# Altium schematic sheet FEATHER.SchDoc
size A3; SheetNumber: 5; SheetTotal: 7
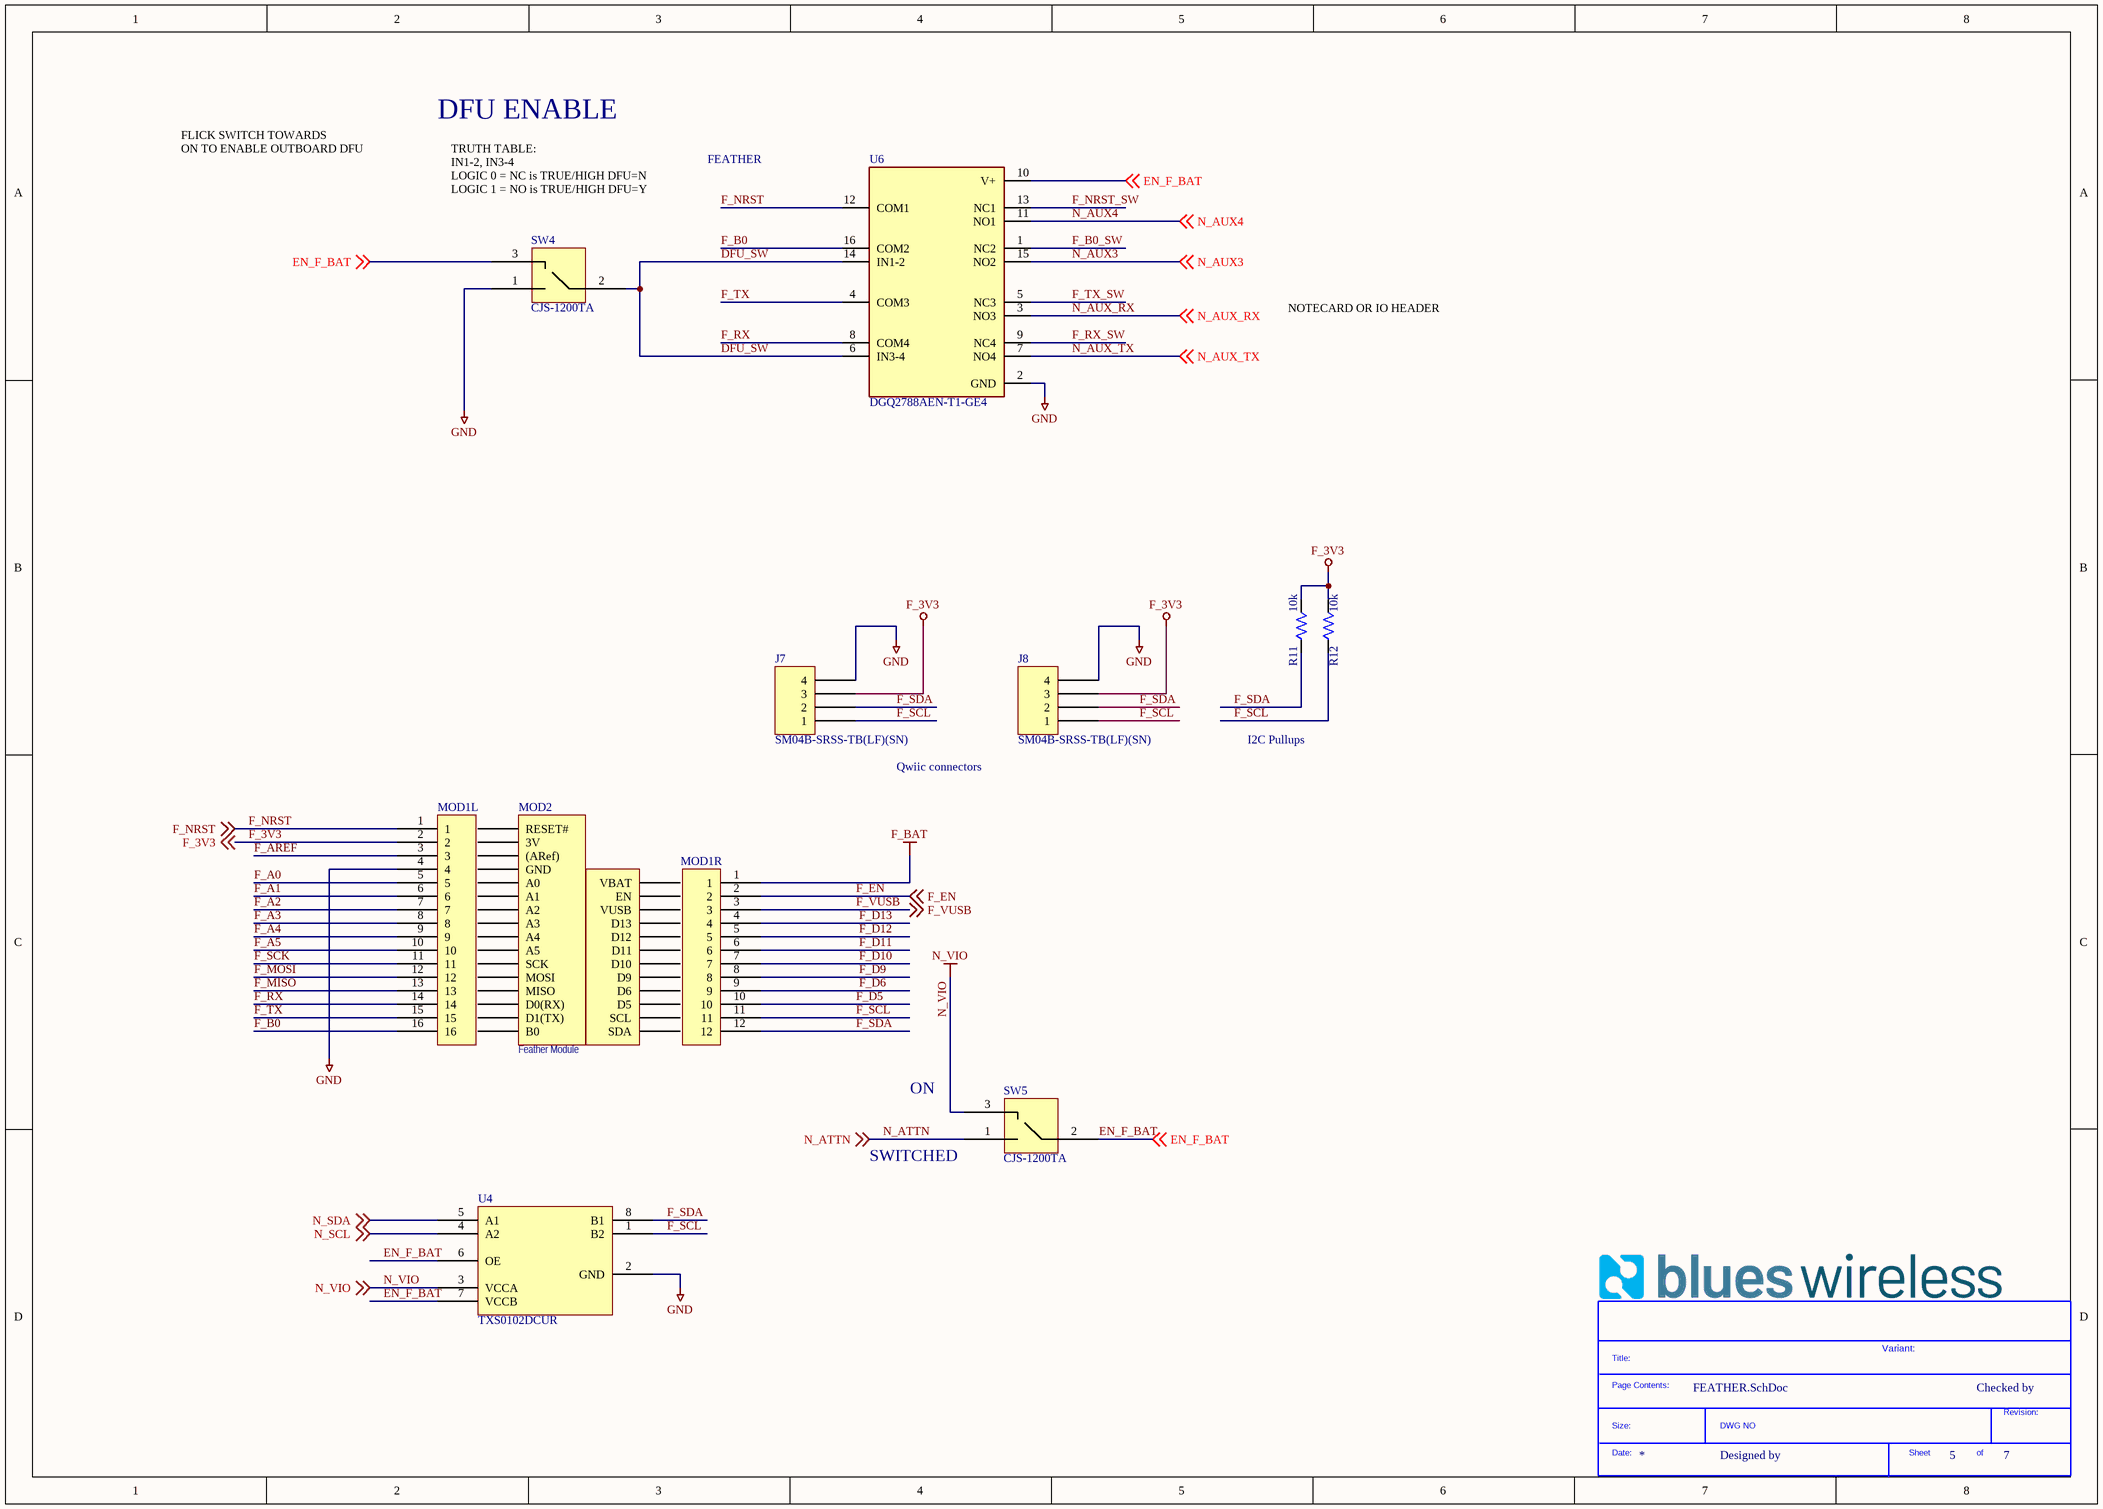
[diagram p0: FEATHER.SchDoc]

## Parts
*?  SDTitleBlock  (value not drawn)  (graphical)
J7  SM04B-SRSS-TB(LF)(SN)  [JST SM04B-SRSS-TB]
J8  SM04B-SRSS-TB(LF)(SN)  [JST SM04B-SRSS-TB]
MOD1L  Socket 16-Pin, 0.100 inch (0.335 inch body)  [16PIN_254MM]  (value not drawn)
MOD1R  Socket 12-Pin, 0.100 inch (0.335 inch body)  [12PIN_254MM]  (value not drawn)
MOD2  Feather Module  [BLUES_WIRELESS_SWAN_2-54_HEADERS]  (no BOM)
R11  10k  [RES 0402_1005]
R12  10k  [RES 0402_1005]
SW4  CJS-1200TA  [SW_CJS-1200TA]
SW5  CJS-1200TA  [SW_CJS-1200TA]
U4  TXS0102DCUR  [SOP50P310X90-8N]
U6  DGQ2788AEN-T1-GE4  [QFN40P260X180X60-16N]

## Nets
F_3V3: J7.3 J8.3 MOD1L.2 R11.2 R12.2 ; off-sheet F_3V3
F_BAT: MOD1R.1
GND: J7.4 J8.4 MOD1L.4 SW4.1 U4.2(GND) U6.2(GND)
N_VIO: SW5.3 U4.3(VCCA) ; off-sheet N_VIO
DFU_SW: SW4.2 U6.6(IN3-4) U6.14(IN1-2)
EN_F_BAT: SW4.3 SW5.2 U4.6(OE) U4.7(VCCB) U6.10(V+) ; off-sheet EN_F_BAT
F_A0: MOD1L.5
F_A1: MOD1L.6
F_A2: MOD1L.7
F_A3: MOD1L.8
F_A4: MOD1L.9
F_A5: MOD1L.10
F_AREF: MOD1L.3
F_B0: MOD1L.16 U6.16(COM2)
F_B0_SW: U6.1(NC2)
F_D5: MOD1R.10
F_D6: MOD1R.9
F_D9: MOD1R.8
F_D10: MOD1R.7
F_D11: MOD1R.6
F_D12: MOD1R.5
F_D13: MOD1R.4
F_EN: MOD1R.2 ; off-sheet F_EN
F_MISO: MOD1L.13
F_MOSI: MOD1L.12
F_NRST: MOD1L.1 U6.12(COM1) ; off-sheet F_NRST
F_NRST_SW: U6.13(NC1)
F_RX: MOD1L.14 U6.8(COM4)
F_RX_SW: U6.9(NC4)
F_SCK: MOD1L.11
F_SCL: J7.1 J8.1 MOD1R.11 R12.1 U4.1(B2)
F_SDA: J7.2 J8.2 MOD1R.12 R11.1 U4.8(B1)
F_TX: MOD1L.15 U6.4(COM3)
F_TX_SW: U6.5(NC3)
F_VUSB: MOD1R.3 ; off-sheet F_VUSB
N_ATTN: SW5.1 ; off-sheet N_ATTN
N_AUX3: U6.15(NO2) ; off-sheet N_AUX3
N_AUX4: U6.11(NO1) ; off-sheet N_AUX4
N_AUX_RX: U6.3(NO3) ; off-sheet N_AUX_RX
N_AUX_TX: U6.7(NO4) ; off-sheet N_AUX_TX
N_SCL: U4.4(A2) ; off-sheet N_SCL
N_SDA: U4.5(A1) ; off-sheet N_SDA

Not connected (* = marked no-connect by the designer): MOD2 1(RESET#) 2(3V) 3((ARef)) 4(GND) 5(A0) 6(A1) 7(A2) 8(A3) 9(A4) 10(A5) 11(SCK) 12(MOSI) 13(MISO) 14(D0(RX)) 15(D1(TX)) 16(B0) 17(SDA) 18(SCL) 19(D5) 20(D6) 21(D9) 22(D10) 23(D11) 24(D12) 25(D13) 26(VUSB) 27(EN) 28(VBAT)

## Notes on the sheet
- FLICK SWITCH TOWARDS
  ON TO ENABLE OUTBOARD DFU
- DFU ENABLE
- FEATHER
- (near SW4) TRUTH TABLE:
  IN1-2, IN3-4
  LOGIC 0 = NC is TRUE/HIGH DFU=N
  LOGIC 1 = NO is TRUE/HIGH DFU=Y
- NOTECARD OR IO HEADER
- Qwiic connectors
- I2C Pullups
- ON
- SWITCHED
- Variant:
- Checked by
- Designed by
- (in symbol SDTitleBlock) Title:; Page Contents:; Revision:; Size:; DWG NO; Date:; Sheet; of

## Library data of the parts
J7 J8 = SM04B-SRSS-TB(LF)(SN): CONN HEADER SH 4POS SIDE 1MM TIN; Manufacturer: JST; Number of Positions: 4; Connector Type: Male Pin; Contact Resistance: 40mR; Max Current Rating: 1A; Max Voltage Rating (AC): 50V; Pitch: 0.039inch; Supplier 1: Digi-Key; Manufacturer Part Number: SM04B-SRSS-TB(LF)(SN); RoHS: Yes; Category: Connectors; Pricing 1: 1=0.57000, 10=0.49300, 100=0.40630, 500=0.35328, 1000=0.29146 (USD); Mount: Surface Mount; Contact Material: Copper Alloy; Contact Plating: Tin,Copper; Color: Natural; Housing Color: Beige; Housing Material: Polyamide; Min Operating Temperature: -25°C; Max Operating Temperature: 85°C; Number of Rows: 1; Termination: Solder; Packaging: Tape and Reel; Orientation: Right Angle; Number of Contacts: 4; Max Voltage Rating (DC): 50V; Length: 6mm; Depth: 4.95mm; Lead Free: Lead Free; ComponentLink1URL: https://datasheet.ciiva.com/26894/getdatasheetpartid-640736-26894676.pdf?src-supplier=Verical; ComponentLink1Description: https://datasheet.ciiva.com/26894/getdatasheetpartid-640736-26894676.pdf?src-supplier=Verical; ComponentLink2URL: https://datasheet.ciiva.com/26894/getdatasheetpartid-499363-26894945.pdf?src-supplier=Verical; ComponentLink2Description: https://datasheet.ciiva.com/26894/getdatasheetpartid-499363-26894945.pdf?src-supplier=Verical; ComponentLink3URL: https://datasheet.ciiva.com/16487/jstsm04b-srss-tb-lf-sn-16487222.pdf?src-supplier=Future+Electronics; ComponentLink3Description: https://datasheet.ciiva.com/16487/jstsm04b-srss-tb-lf-sn-16487222.pdf?src-supplier=Future+Electronics; Supplier Part Number 1: 455-1804-1-ND
MOD1L = SOCKET_LFB_16: Socket 16-Pin, 0.100 in
MOD1R = SOCKET_LFB_12: Socket 12-Pin, 0.100 in
MOD2 = ADAFRUIT_FEATHER_COMMON_1: Typical Adafruit Feather Pinout
R11 R12 = RC1005F103CS: Res Thick Film 0402 10K Ohm 1% 1/16W ±100ppm/°C Molded SMD SMD T/R; Manufacturer: Samsung; Resistance: 10kR; Power Rating: 63mW; Supplier 1: Digi-Key; Manufacturer Part Number: RC1005F103CS; RoHS: Yes; Category: Chip SMD Resistors; Stock 1: 58620569; Pricing 1: 10000=0.00695 (USD); Mount: Surface Mount; Case/Package: 0402; Case Code (Metric): 1005; Case Code (Imperial): 0402; Contact Plating: Tin; Size Code: 0402; Min Operating Temperature: -55°C; Max Operating Temperature: 155°C; Tolerance: 1%; Packaging: Tape and Reel; Resistor Type: Thick Film; Package Quantity: 1; Number of Terminations: 2; Max Power Dissipation: 63mW; Temperature Coefficient: 100ppm/°C; Features: Moisture Resistant; Series: RC; Construction: Rectangular; Length: 0.039inch; Width: 0.02inch; Height: 0.016inch; Depth: 0.5mm; Radiation Hardening: No; Military Standard: Not; RoHS Compliant: Yes; ComponentLink1URL: https://datasheet.ciiva.com/15196/getdatasheetpartid-504789-15196214.pdf?src-supplier=Verical; ComponentLink1Description: https://datasheet.ciiva.com/15196/getdatasheetpartid-504789-15196214.pdf?src-supplier=Verical; ComponentLink2URL: https://datasheet.ciiva.com/16481/rcseries-16481007.pdf?src-supplier=Future+Electronics; ComponentLink2Description: https://datasheet.ciiva.com/16481/rcseries-16481007.pdf?src-supplier=Future+Electronics; Supplier Part Number 1: 1276-3431-2-ND
SW4 SW5 = CJS-1200TA: Switch Slide N.O./N.C. SPDT Raised Slide 0.1A 24VDC J-Hook SMD Embossed T/R; Manufacturer: Nidec Copal; Body Material: Polyphenylene; Voltage Rating (DC): 6V; Electrical Life: 200Cycles; Max Voltage Rating (DC): 24V; Current Rating: 100mA; Number of Positions: 2; Actuator Type: Slide (Standard); Washable: Yes; Supplier 1: Digi-Key; Manufacturer Part Number: CJS-1200TA; RoHS: Yes; Category: Slide Switches; Pricing 1: 1=0.81000, 10=0.78400, 25=0.75440, 100=0.65470, 250=0.59736, 500=0.55510 (USD); Mount: Surface Mount; Contact Material: Copper Alloy; Contact Plating: Gold; Min Operating Temperature: -40°C; Max Operating Temperature: 85°C; Packaging: Tape and Reel; Throw Configuration: SPDT; Termination: J-Hook; Series: CJS; Orientation: Vertical; Length: 0.212inch; Radiation Hardening: No; RoHS Compliant: Yes; Lead Free: Lead Free; ComponentLink1URL: https://datasheet.ciiva.com/2864/cjs-2864476.pdf?src-supplier=Digi-Key; ComponentLink1Description: https://datasheet.ciiva.com/2864/cjs-2864476.pdf?src-supplier=Digi-Key; ComponentLink2URL: https://datasheet.ciiva.com/2864/cjs-2864477.pdf?src-supplier=Digi-Key; ComponentLink2Description: https://datasheet.ciiva.com/2864/cjs-2864477.pdf?src-supplier=Digi-Key; ComponentLink3URL: https://datasheet.ciiva.com/2864/cjs-2864478.pdf?src-supplier=Digi-Key; ComponentLink3Description: https://datasheet.ciiva.com/2864/cjs-2864478.pdf?src-supplier=Digi-Key; Supplier Part Number 1: 563-1021-6-ND
U4 = TXS0102DCUR: 2-Bit Bidirectional Voltage-Level Shifter for Open-Drain and Push-Pull Application 8-VSSOP -40 to 85; Manufacturer: Texas Instruments; Min Supply Voltage: 1.65V; Max Supply Voltage: 5.5V; Data Rate: 24Mbps; Propagation Delay: 4.6ns; Logic Function: Translator; Number of Bits: 2; High Level Output Current: -20uA; Low Level Output Current: 1mA; Quiescent Current: 14.4uA; Turn-On Delay Time: 260ns; Output Current: 1A; Supplier 1: Digi-Key; Manufacturer Part Number: TXS0102DCUR; RoHS: Yes; Category: Voltage Level Shifters; Pricing 1: 1=0.80000, 10=0.70000, 25=0.65720, 100=0.53640, 250=0.49820, 500=0.42400, 1000=0.35000 (USD); Case/Package: VSSOP; Number of Pins: 8; Weight: 0.000339oz; Min Operating Temperature: -40°C; Max Operating Temperature: 85°C; Packaging: Tape and Reel; Package Quantity: 1; Number of Channels: 2; Number of Inputs: 2; Nominal Supply Current: 14.4uA; Output Type: Voltage; Radiation Hardening: No; Lead Free: Lead Free; RoHS Compliant: Yes; REACH SVHC: No SVHC; ComponentLink1URL: https://datasheet.ciiva.com/22653/1846850-22653373.pdf?src-supplier=Farnell; ComponentLink1Description: https://datasheet.ciiva.com/22653/1846850-22653373.pdf?src-supplier=Farnell; ComponentLink2URL: https://datasheet.ciiva.com/15096/getdatasheetpartid-118249-15096172.pdf?src-supplier=Verical; ComponentLink2Description: https://datasheet.ciiva.com/15096/getdatasheetpartid-118249-15096172.pdf?src-supplier=Verical; ComponentLink3URL: https://datasheet.ciiva.com/1508/1857232-1508821.pdf?src-supplier=Element14; ComponentLink3Description: https://datasheet.ciiva.com/1508/1857232-1508821.pdf?src-supplier=Element14; ComponentLink4URL: https://datasheet.ciiva.com/28499/1863639-28499676.pdf?src-supplier=Element14; ComponentLink4Description: https://datasheet.ciiva.com/28499/1863639-28499676.pdf?src-supplier=Element14; ComponentLink5URL: https://datasheet.ciiva.com/46395/1863639-46395871.pdf?src-supplier=Element14; ComponentLink5Description: https://datasheet.ciiva.com/46395/1863639-46395871.pdf?src-supplier=Element14; ComponentLink6URL: https://datasheet.ciiva.com/1899/txs0102-1899369.pdf?src-supplier=Digi-Key; ComponentLink6Description: https://datasheet.ciiva.com/1899/txs0102-1899369.pdf?src-supplier=Digi-Key; ComponentLink7URL: https://datasheet.ciiva.com/1899/txs0102-1899368.pdf?src-supplier=Digi-Key; ComponentLink7Description: https://datasheet.ciiva.com/1899/txs0102-1899368.pdf?src-supplier=Digi-Key; ComponentLink8URL: https://datasheet.ciiva.com/1899/txs0102-1899370.pdf?src-supplier=Digi-Key; ComponentLink8Description: https://datasheet.ciiva.com/1899/txs0102-1899370.pdf?src-supplier=Digi-Key; ComponentLink9URL: https://datasheet.ciiva.com/14287/txs0102-14287516.pdf?src-supplier=Avnet; ComponentLink9Description: https://datasheet.ciiva.com/14287/txs0102-14287516.pdf?src-supplier=Avnet; ComponentLink10URL: https://datasheet.ciiva.com/14287/txs0102-14287518.pdf?src-supplier=Avnet; ComponentLink10Description: https://datasheet.ciiva.com/14287/txs0102-14287518.pdf?src-supplier=Avnet; Supplier Part Number 1: 296-21931-6-ND
U6 = DGQ2788AEN-T1-GE4: Analog Switch Quad SPDT Automotive 16-Pin Mini-QFN T/R; Manufacturer: Vishay; Number of Circuits: 2; On-State Resistance: 500mR; -3db Bandwidth: 338MHz; Supplier 1: Arrow Electronics; Manufacturer Part Number: DGQ2788AEN-T1-GE4; RoHS: Yes; Category: Interface ICs; Stock 1: 341; Pricing 1: 1=1.03770, 10=0.89200, 25=0.88310, 100=0.69780, 250=0.68760 (USD); Number of Pins: 16; Min Operating Temperature: -40°C; Max Operating Temperature: 125°C; Packaging: Tape and Reel; RoHS Compliant: Yes; ComponentLink1URL: http://www.vishay.com/docs/75683/dgq2788a.pdf?src-supplier=Digi-Key; ComponentLink1Description: http://www.vishay.com/docs/75683/dgq2788a.pdf?src-supplier=Digi-Key; Supplier Part Number 1: DGQ2788AEN-T1-GE4